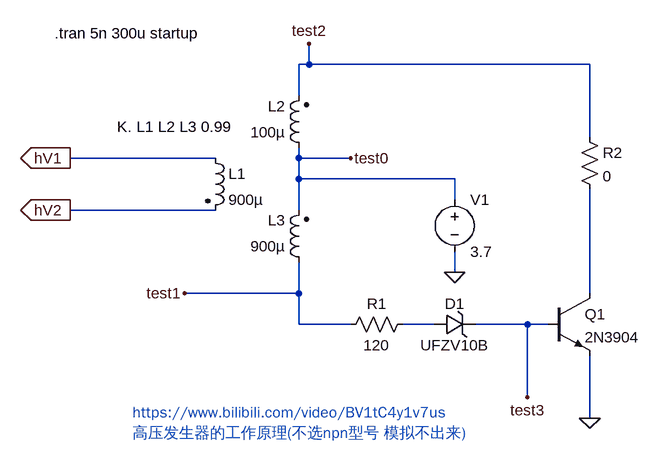
[diagram p0: schematic HighVoltageGenerator.asc]
HighVoltageGenerator.asc, the LTspice schematic file:
Version 4
SHEET 1 880 688
WIRE 192 80 192 48
WIRE 192 80 176 80
WIRE 624 80 192 80
WIRE 176 128 176 80
WIRE 624 192 624 80
WIRE 48 224 -176 224
WIRE 176 224 176 208
WIRE 256 224 176 224
WIRE 176 256 176 224
WIRE 416 256 176 256
WIRE 416 288 416 256
WIRE 48 304 -176 304
WIRE 176 304 176 256
WIRE 416 400 416 368
WIRE 176 432 176 384
WIRE 176 432 0 432
WIRE 624 432 624 272
WIRE 176 480 176 432
WIRE 256 480 176 480
WIRE 384 480 336 480
WIRE 528 480 448 480
WIRE 560 480 528 480
WIRE 528 592 528 480
WIRE 624 624 624 528
FLAG 624 624 0
FLAG 416 400 0
FLAG -176 224 hV1
IOPIN -176 224 Out
FLAG -176 304 hV2
IOPIN -176 304 Out
FLAG 0 432 test1
FLAG 192 48 test2
FLAG 528 592 test3
FLAG 256 224 test0
SYMBOL ind2 32 208 R0
SYMATTR InstName L1
SYMATTR Value 900µ
SYMATTR Type ind
SYMBOL ind2 192 224 R180
WINDOW 0 36 80 Left 2
WINDOW 3 36 40 Left 2
SYMATTR InstName L2
SYMATTR Value 100µ
SYMATTR Type ind
SYMBOL ind2 192 400 R180
WINDOW 0 36 80 Left 2
WINDOW 3 36 40 Left 2
SYMATTR InstName L3
SYMATTR Value 900µ
SYMATTR Type ind
SYMBOL Res 352 464 R90
WINDOW 0 0 56 VBottom 2
WINDOW 3 32 56 VTop 2
SYMATTR InstName R1
SYMATTR Value 120
SYMBOL zener 384 496 R270
WINDOW 0 32 32 VTop 2
WINDOW 3 0 32 VBottom 2
SYMATTR InstName D1
SYMATTR Value UFZV10B
SYMATTR Description Diode
SYMATTR Type diode
SYMBOL voltage 416 272 R0
SYMATTR InstName V1
SYMATTR Value 3.7
SYMBOL Res 608 176 R0
SYMATTR InstName R2
SYMATTR Value 0
SYMBOL npn 560 432 R0
SYMATTR InstName Q1
SYMATTR Value 2N3904
TEXT -104 176 Left 2 !K. L1 L2 L3 0.99
TEXT -80 616 Left 2 ;https://www.bilibili.com/video/BV1tC4y1v7us\n高压发生器的工作原理(不选npn型号 模拟不出来)
TEXT -200 32 Left 2 !.tran 5n 300u startup

The netlist it stands for:
* HighVoltageGenerator.asc
L1 hV1 hV2 900µ
L2 test0 test2 100µ
L3 test1 test0 900µ
R1 N002 test1 120
D1 N002 test3 UFZV10B
V1 test0 0 3.7
R2 test2 N001 0
Q1 N001 test3 0 0 2N3904
.model D D
.lib standard.dio
.model NPN NPN
.model PNP PNP
.lib standard.bjt
K. L1 L2 L3 0.99
* https://www.bilibili.com/video/BV1tC4y1v7us
* 高压发生器的工作原理(不选npn型号 模拟不出来)
.tran 5n 300u startup
.backanno
.end